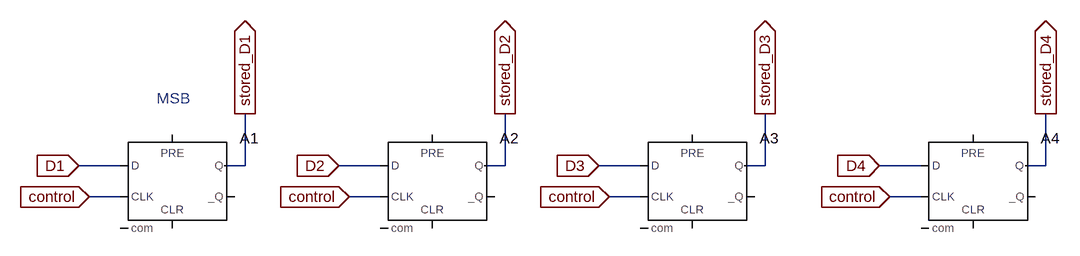
[diagram p0: schematic latches.asc]
latches.asc, the LTspice schematic file:
Version 4
SHEET 1 880 680
WIRE -2416 128 -2480 128
WIRE -2224 128 -2224 48
WIRE -2224 128 -2256 128
WIRE -2016 128 -2080 128
WIRE -1824 128 -1824 48
WIRE -1824 128 -1856 128
WIRE -1616 128 -1680 128
WIRE -1424 128 -1424 48
WIRE -1424 128 -1456 128
WIRE -1184 128 -1248 128
WIRE -992 128 -992 48
WIRE -992 128 -1024 128
WIRE -2416 176 -2464 176
WIRE -2016 176 -2064 176
WIRE -1616 176 -1664 176
WIRE -1184 176 -1232 176
FLAG -992 48 stored_D4
IOPIN -992 48 Out
FLAG -1232 176 control
IOPIN -1232 176 In
FLAG -1248 128 D4
IOPIN -1248 128 In
FLAG -1424 48 stored_D3
IOPIN -1424 48 Out
FLAG -1664 176 control
IOPIN -1664 176 In
FLAG -1680 128 D3
IOPIN -1680 128 In
FLAG -1824 48 stored_D2
IOPIN -1824 48 Out
FLAG -2064 176 control
IOPIN -2064 176 In
FLAG -2080 128 D2
IOPIN -2080 128 In
FLAG -2224 48 stored_D1
IOPIN -2224 48 Out
FLAG -2464 176 control
IOPIN -2464 176 In
FLAG -2480 128 D1
IOPIN -2480 128 In
SYMBOL Digital\\dflop -1104 80 R0
SYMATTR InstName A4
SYMBOL Digital\\dflop -1536 80 R0
SYMATTR InstName A3
SYMBOL Digital\\dflop -1936 80 R0
SYMATTR InstName A2
SYMBOL Digital\\dflop -2336 80 R0
SYMATTR InstName A1
TEXT -2360 24 Left 2 ;MSB

The netlist it stands for:
* latches.asc
A4 D4 0 control 0 0 0 stored_D4 0 DFLOP
A3 D3 0 control 0 0 0 stored_D3 0 DFLOP
A2 D2 0 control 0 0 0 stored_D2 0 DFLOP
A1 D1 0 control 0 0 0 stored_D1 0 DFLOP
* MSB
.backanno
.end